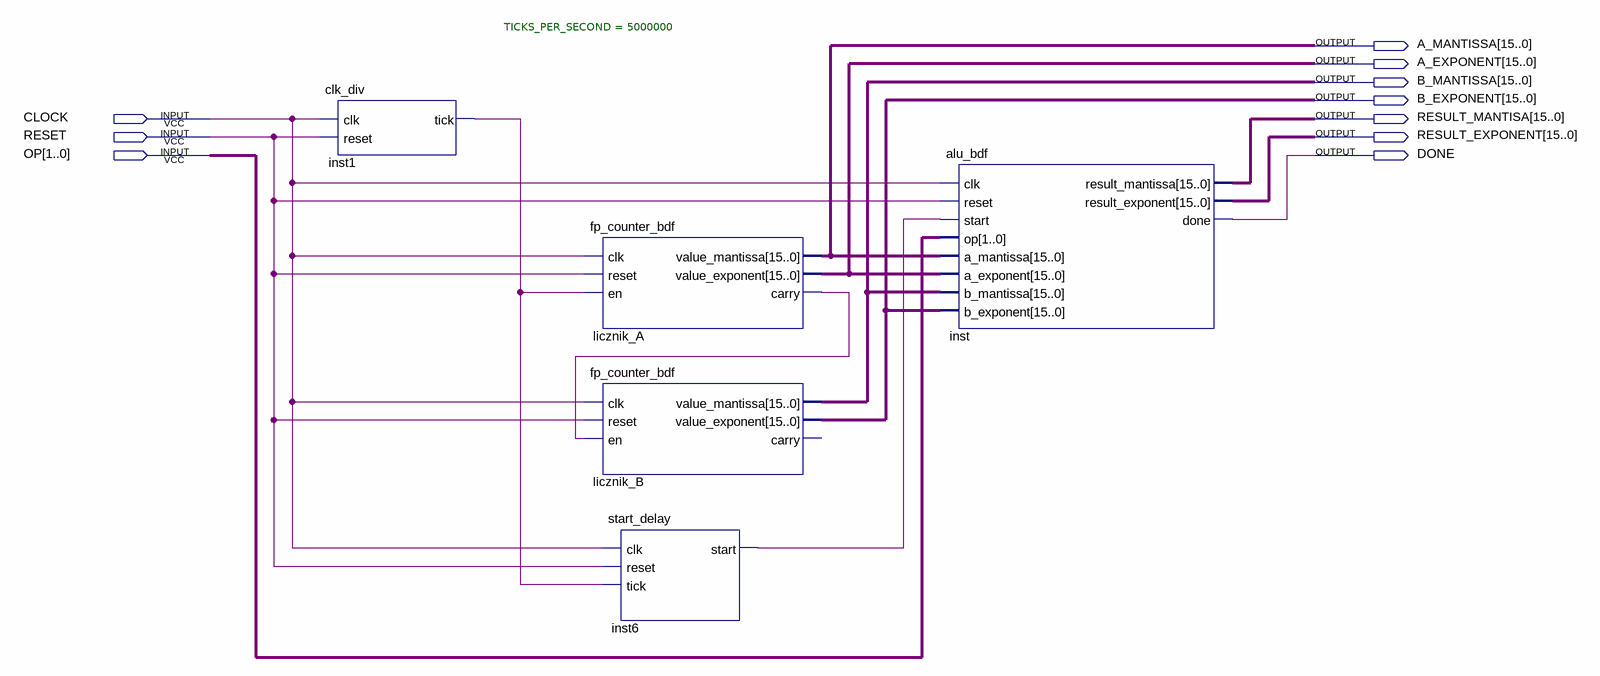
[diagram p0: schematic sheet]
// Quartus schematic demo.bdf as structural Verilog: 5 symbols, 10 pins
module demo (
  input  CLOCK,
  input  RESET,
  input  [1:0] OP,
  output [15:0] A_MANTISSA,
  output [15:0] A_EXPONENT,
  output [15:0] B_MANTISSA,
  output [15:0] B_EXPONENT,
  output [15:0] RESULT_MANTISA,
  output [15:0] RESULT_EXPONENT,
  output DONE
);

  wire inst1_tick, inst6_start, licznik_A_carry;

  clk_div #(.TICKS_PER_SECOND(5000000)) inst1 (.clk(CLOCK), .reset(RESET), .tick(inst1_tick));
  fp_counter_bdf licznik_A (
    .clk(CLOCK), .reset(RESET), .en(inst1_tick), .value_mantissa(A_MANTISSA), .value_exponent(A_EXPONENT),
    .carry(licznik_A_carry));
  fp_counter_bdf licznik_B (
    .clk(CLOCK), .reset(RESET), .en(licznik_A_carry), .value_mantissa(B_MANTISSA), .value_exponent(B_EXPONENT));  // open: carry
  start_delay inst6 (.clk(CLOCK), .reset(RESET), .tick(inst1_tick), .start(inst6_start));
  alu_bdf inst (
    .clk(CLOCK), .reset(RESET), .start(inst6_start), .op(OP), .a_mantissa(A_MANTISSA),
    .a_exponent(A_EXPONENT), .b_mantissa(B_MANTISSA), .b_exponent(B_EXPONENT),
    .result_mantissa(RESULT_MANTISA), .result_exponent(RESULT_EXPONENT), .done(DONE));
endmodule
